# Altium schematic sheet Buttonboard.SchDoc
size A
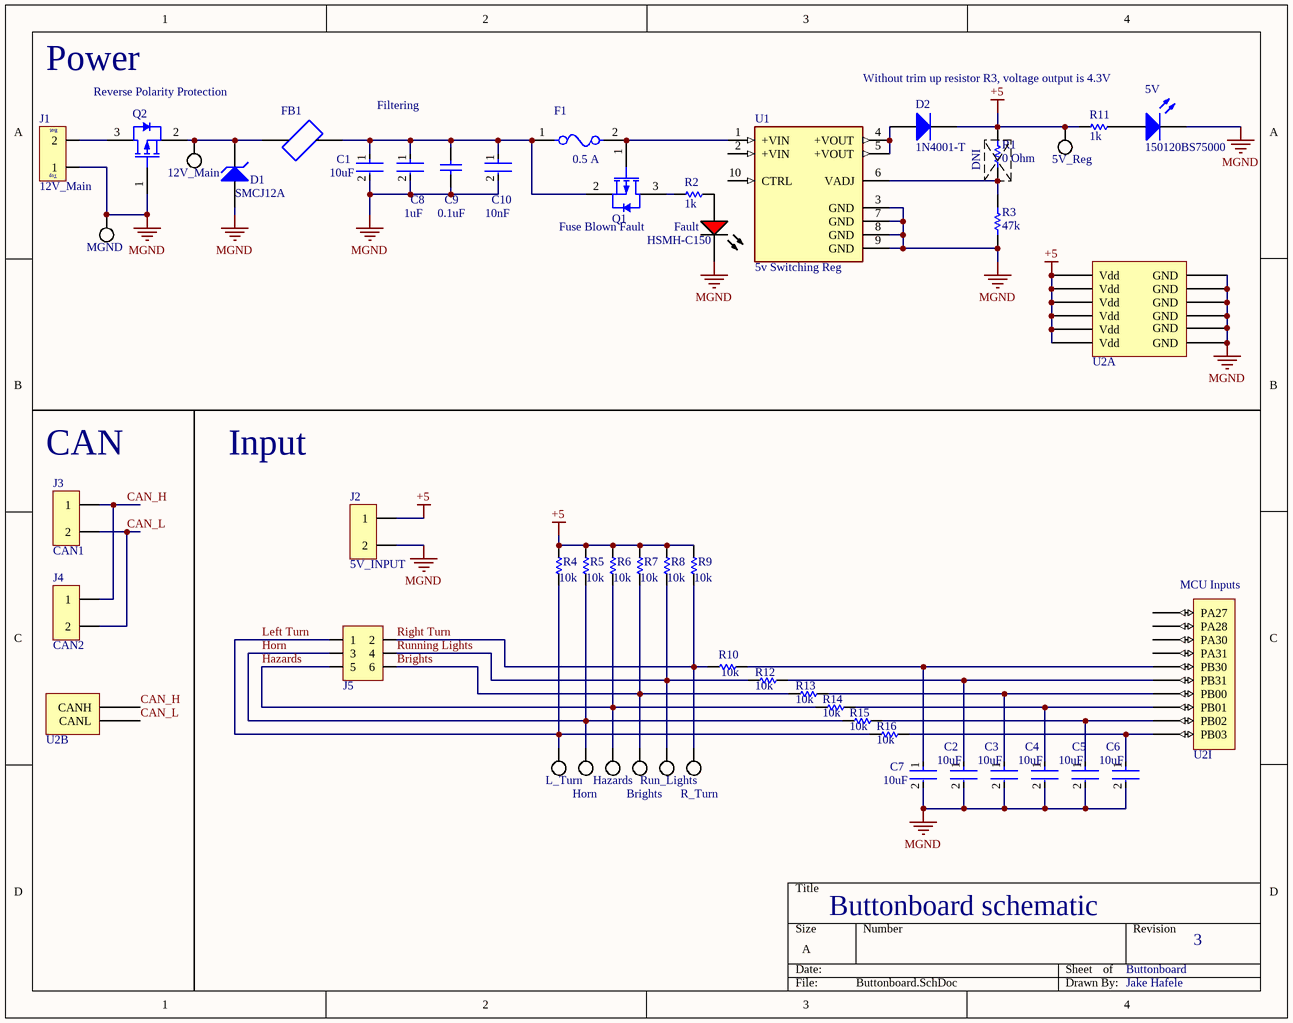
[diagram p0: Buttonboard.SchDoc]

## Parts
5V  150120BS75000  [1206_A]
5V_Reg  EPAD  [EPAD]  (value not drawn)  (no BOM)
12V_Main  EPAD  [EPAD]  (value not drawn)  (no BOM)
Brights  EPAD  [EPAD]  (value not drawn)  (no BOM)
C1  Capacitance: 10uF  [FP-CL31-IPC_A]  (hidden comment: CL31A106MOHNNNE)
C2  Capacitance: 10uF  [FP-CL31-IPC_A]  (hidden comment: CL31A106MOHNNNE)
C3  Capacitance: 10uF  [FP-CL31-IPC_A]  (hidden comment: CL31A106MOHNNNE)
C4  Capacitance: 10uF  [FP-CL31-IPC_A]  (hidden comment: CL31A106MOHNNNE)
C5  Capacitance: 10uF  [FP-CL31-IPC_A]  (hidden comment: CL31A106MOHNNNE)
C6  Capacitance: 10uF  [FP-CL31-IPC_A]  (hidden comment: CL31A106MOHNNNE)
C7  Capacitance: 10uF  [FP-CL31-IPC_A]  (hidden comment: CL31A106MOHNNNE)
C8  Capacitance: 1uF  [FP-CL31-IPC_A]  (hidden comment: CL31F105ZOCNNNC)
C9  Capacitance: 0.1uF  [CAPC2013X94X50LL20T25]  (hidden comment: 08055C104JAT2A)
C10  Capacitance: 10nF  [FP-CGA3E-0_3-0_1-IPC_A]  (hidden comment: CGA3E2X8R2A103K080AD)
D1  SMCJ12A  [LFUS-DO-214AB-2_V]
D2  1N4001-T  [DIOD-DO-41-P-2_V]
DNI  DO NOT INSTALL  (value not drawn)  (graphical)
F1  0.5 A  [FP-0155-MFG]
Fault  HSMH-C150  [AVAG-HSMX-C150_V]
FB1  HI1206N800R-10  [FB_HI1206N800R-10]  (value not drawn)
Hazards  EPAD  [EPAD]  (value not drawn)  (no BOM)
Horn  EPAD  [EPAD]  (value not drawn)  (no BOM)
J1  12V_Main  [CONN_2P_MEGAFIT_HORIZONTAL]
J2  5V_INPUT  [Mini-Fit Jr. 2]
J3  CAN1  [Mini-Fit Jr. 2]
J4  CAN2  [Mini-Fit Jr. 2]
J5  Molex Mini-Fit Jr. 6-Pin  [Molex Mini-Fit Jr. 6-Pin]  (value not drawn)
L_Turn  EPAD  [EPAD]  (value not drawn)  (no BOM)
MGND  EPAD  [EPAD]  (value not drawn)  (no BOM)
Q1  Fuse Blown Fault  [INTR-SOT-23-3_V]
Q2  Reverse Polarity Protection  [INTR-SOT-23-3_V]
R1  0 Ohm  [RESC2013X50X30LL20T20]
R2  value 1k  [0805_B]  (hidden comment: Resistor)
R3  47k  [RESC2013X60X35ML10T20]
R4  value 10k  [0805_B]  (hidden comment: 1% 1/8W)
R5  value 10k  [0805_B]  (hidden comment: 1% 1/8W)
R6  value 10k  [0805_B]  (hidden comment: 1% 1/8W)
R7  value 10k  [0805_B]  (hidden comment: 1% 1/8W)
R8  value 10k  [0805_B]  (hidden comment: 1% 1/8W)
R9  value 10k  [0805_B]  (hidden comment: 1% 1/8W)
R10  value 10k  [0805_B]  (hidden comment: 1% 1/8W)
R11  value 1k  [0805_B]  (hidden comment: Resistor)
R12  value 10k  [0805_B]  (hidden comment: 1% 1/8W)
R13  value 10k  [0805_B]  (hidden comment: 1% 1/8W)
R14  value 10k  [0805_B]  (hidden comment: 1% 1/8W)
R15  value 10k  [0805_B]  (hidden comment: 1% 1/8W)
R16  value 10k  [0805_B]  (hidden comment: 1% 1/8W)
R_Turn  EPAD  [EPAD]  (value not drawn)  (no BOM)
Run_Lights  EPAD  [EPAD]  (value not drawn)  (no BOM)
U1  5v Switching Reg  [5v Reg]
U2  S+  [Compute S+]  (value not drawn)  (parts A,B,I of 9)

## Nets
+5: 5V_Reg.1 D2.2(K) J2.1 R1.2 R4.2 R5.2 R6.2 R7.2 R8.2 R9.2 R11.2 U2.Vdd
MGND: 5V.1(K) C1.2 C2.2 C3.2 C4.2 C5.2 C6.2 C7.2 C8.2 C9.1 C10.2 D1.1(A) Fault.2(K) J1.1 J2.2 MGND.1 Q2.1(GATE) R3.1 U1.3(GND) U1.7(GND) U1.8(GND) U1.9(GND) U2.GND
Brights: Brights.1 J5.6 R7.1 R13.2
CAN_H: J3.1 J4.1 U2.CANH
CAN_L: J3.2 J4.2 U2.CANL
Hazards: Hazards.1 J5.5 R6.1 R14.2
Horn: Horn.1 J5.3 R5.1 R15.2
Left Turn: J5.1 L_Turn.1 R4.1 R16.2
Right Turn: J5.2 R9.1 R10.2 R_Turn.1
Running Lights: J5.4 R8.1 R12.2 Run_Lights.1
Net5V_2: 5V.2(A) R11.1
Net12V_Main_1: 12V_Main.1 D1.2(K) FB1.1 Q2.2(SOURCE)
NetC1_1: C1.1 C8.1 C9.2 C10.1 F1.1 FB1.2 Q1.2(SOURCE)
NetC2_1: C2.1 R12.1 U2.PB31
NetC3_1: C3.1 R13.1 U2.PB00
NetC4_1: C4.1 R14.1 U2.PB01
NetC5_1: C5.1 R15.1 U2.PB02
NetC6_1: C6.1 R16.1 U2.PB03
NetC7_1: C7.1 R10.1 U2.PB30
NetD2_1: D2.1(A) U1.4(+VOUT) U1.5(+VOUT)
NetF1_2: F1.2 Q1.1(GATE) U1.1(+VIN)
NetFault_1: Fault.1(A) R2.2
NetJ1_2: J1.2 Q2.3(DRAIN)
NetQ1_3: Q1.3(DRAIN) R2.1
NetR1_1: R1.1 R3.2 U1.6(VADJ)

Not connected (* = marked no-connect by the designer): U1 2(+VIN) 10(CTRL); U2 PA27 PA28 PA30 PA31

## Notes on the sheet
- Power
- Without trim up resistor R3, voltage output is 4.3V
- Filtering
- (near J3) CAN
- Input
- (near U2) MCU Inputs
- Buttonboard schematic
- Buttonboard
- 3
- Jake Hafele
- (in symbol CONN_2P_MEGAFIT_HORIZONTAL) Bot.; Top

## Library data of the parts
5V = CMP-1426-00015-1: SMD mono-color Chip LED, WL-SMCW, Blue; Manufacturer: Wuerth Elektronik; ComponentLink2Description: Datasheet; ComponentLink1URL: http://www.we-online.com; PartNumber: 150120BS75000; ComponentLink1Description: Manufacturer URL; ComponentLink2URL: http://katalog.we-online.com/led/datasheet/150120BS75000.pdf; PackageReference: 1206_A; Color: Blue
5V_Reg 12V_Main Brights Hazards Horn L_Turn MGND R_Turn Run_Lights = EPAD: Pad for probing signals
C1-C7 = CMP-13271-002453-1: Cap Ceramic 10uF 16V X5R ±20% SMD 1206 +85°C Embossed T/R; Thickness: 0.071inch; Case Code (Imperial): 1206; Case Code (Metric): 3216; Height: 1.6mm; Max Operating Temperature: 85°C; Voltage Rating: 16V; Package Quantity: 1; Length: 3.2mm; Dielectric: X5R; Voltage Rating (DC): 16V; Tolerance: 20%; Case/Package: 1206; Depth: 1.6mm; Mount: Surface Mount; Radiation Hardening: No; Width: 0.063inch; Lead Free: Lead Free; Min Operating Temperature: -55°C; Packaging: Tape and Reel
C8 = CMP-13271-003959-1: Cap Ceramic 1uF 16V Y5V -20/+80% SMD 1206 +85°C Embossed T/R; Tolerance: 80%; Length: 3.2mm; Package Quantity: 4000; Lead Free: Lead Free; Height: 0.85mm; Packaging: Tape and Reel; Max Operating Temperature: 85°C; Case Code (Imperial): 1206; Case/Package: 1206; Dielectric: Y5V; Min Operating Temperature: -30°C; Voltage Rating (DC): 16V; Width: 0.063inch; Mount: Surface Mount; Voltage Rating: 16V; Depth: 1.6mm; Thickness: 0.039inch; Radiation Hardening: No; Case Code (Metric): 3216
C9 = CMP-2000-05808-1: Chip Capacitor, 0.1 uF, +/- 5%, 50 V, -55 to 125 degC, 0805 (2012 Metric), RoHS, Tape and Reel; Case Width: 1.25mm; Case Length: 2.01mm; Case Height: 0.94mm; Brand: AVX; Type: StandardX7RMLCCs; Capacitance - nF: 100nF; Dissipation Factor DF: 2.5; Voltage Rating DC: 50V; Temperature Coefficient / Code: +/-15%; Capacitance - pF: 100000pF; Dielectric: X7R; Dimensions: 1.25mmWx2.01mmLx0.94mmH; Product: GeneralTypeMLCCs; Package Description: 2-Pin Surface Mount Device, Body 2.01 x 1.25 mm; Package / Case: 0805(2012metric); Product Category: MultilayerCeramicCapacitorsMLCC-SMD/SMT; Case Code - mm: 2012; Packaging: Reel; Manufacturer URL: http://www.avx.com/; Operating Temperature Range: -55Cto+125C; Termination Style: SMD/SMT; Maximum Operating Temperature: +125C; Case Code - in: 0805; Minimum Operating Temperature: -55C; Factory Pack Quantity: 4000; RoHS: Details; Voltage Rating: 50V; Tolerance: 5%; Package Reference: 0805; Datasheet URL: http://www.farnell.com/datasheets/1679506.pdf; Manufacturer: AVX; Mounting Technology: SurfaceMount; Datasheet Version: 11/2012
C10 = CMP-08246-000769-1: Cap Ceramic 10nF 100V X8R 10% Pad SMD 0603 +150°C Automotive T/R; Mount: Surface Mount; Voltage Rating (DC): 100V; Termination: SMD/SMT; Dielectric: X8R; Case/Package: 0603; Ratings: AEC-Q200; Voltage Rating: 100V; Packaging: Tape and Reel; Thickness: 0.035inch; Composition: Ceramic; Max Operating Temperature: 150°C; Width: 0.031inch; Height: 0.8mm; Weight: 7.1E-05oz; Depth: 0.8mm; Min Operating Temperature: -55°C; Length: 1.6mm; Case Code (Metric): 1608; Tolerance: 10%; Package Quantity: 4000; Case Code (Imperial): 0603
D1 = CMP-2000-07101-1: Transient Voltage Suppression Diode, 12 V, -65 to 150 degC, 2-Pin DO-214AB (SMCJ), RoHS, Tape and Reel; Manufacturer: Littelfuse; Directional: Uni-Directional; Breakdown Voltage-Max: 14.7V; Clamping Voltage-Max: 19.9V; Breakdown Voltage-Min: 13.3V; Power Dissipation: 1500W; Manufacturer URL: http://www.littelfuse.com/; Datasheet Version: 11/2015; Package Description: 2-Pin Surface Mount Device, Body 6.855 x 5.905 mm; Package Reference: DO-214AB; Mounting Technology: SurfaceMount; Datasheet URL: http://www.littelfuse.com/products/tvs-diodes/surface-mount/~/media/electronics/datasheets/tvs_diodes/littelfuse_tvs_diode_smcj_datasheet.pdf.pdf
D2 = CMP-0639-00006-2: 1.0 A Rectifier, 15 pF, 50 V, -65 to 150 degC, 2-Pin DO-41 Plastic, RoHS, Tape and Reel; Manufacturer: Diodes Inc; VF (V): 1; CT (pF): 15; Max. IR (uA): 5; VRRM (V): 50; Max. IFSM (A): 30; RoHS: TRUE; Mounting Technology: Through Hole; PartNumber: 1N4001-T; ComponentLink2Description: Datasheet; DatasheetVersion: Rev. 8-2; Operating Temperature Range (degC): -65 to 150; Packing: Tape and Reel; PackageReference: DO-41-P-2; ComponentLink1URL: http://diodes.com/; PackageDescription: 2-Pin Axial Lead, Body 4.635 x 2.36 mm, Lead Spread 25.4 mm; ComponentLink2URL: http://diodes.com/datasheets/ds28002.pdf; Max. Average Rectified Current IO (A): 1; ComponentLink1Description: Manufacturer URL
DNI = DNI
F1 = CMP-08604-000021-1: FUSE BLOK CARTRIDGE 125V 10A SMD; Manufacturer: Littelfuse Inc; Manufacturer Part Number: 01550900M; Conn Orientation: Horizontal; Fuse Current: 8A; Number Of Fuses: 1; RoHS: TRUE; Device Class L1: Circuit Protection; Package: 0155; Automotive: No; ComponentLink2Description: Datasheet; Lead Free: Yes; Voltage Rating Ac: 125V; ComponentLink2URL: https://www.littelfuse.com/~/media/electronics/datasheets/fuses/littelfuse_fuse_154_154t_154l_154tl_datasheet.pdf.pdf; Octopart: https://octopart.com/01550900m-littelfuse-9291575; Height: 3.81mm; Digikey Description: FUSE BLOK CARTRIDGE 125V 10A SMD; Category: Fuse; Device Class L2: Fuse Holders; Device Class L3: unset; Mouser Description: Fuse Holder ACS NANO HLDR
Fault = CMP-2000-06426-1: LED Uni-Color Red, 65 mW, 25 mA, -40 to 85 degC, 2-Pin SMD, RoHS, Tape and Reel; Manufacturer: Avago; Product Height (mm): 1.1mm; Power Dissipation: 78W; Product Length (mm): 3.2mm; Forward Voltage: 2.6V; Luminous Intensity: 17mcd; DELETED: Compliant; Shape Type: Rectangular; Peak Wavelength: 660nm; Main Category: ChipLED; Dominant Wave Length: 639nm; Rad Hardened: No; Lens Type: ColorlessDiffused; Product Depth (mm): 1.6mm; Reverse Voltage: 5V; Forward Current: 25mA; Chip Material: GaAlAs; Test Current (It): 20mA; Viewing Angle: 170deg; Number of  Elements: 1; Type: Uni-Color; Package Reference: HSMX-C150; Package Description: 2-Pin Surface Mount Device, Body 3.2 x 1.6 mm; Operating Temp Range: -40Cto85C; Mounting: SurfaceMount; Emitting Color: Red; Pin Count: 2; Operating Temperature Classification: Industrial; Datasheet URL: http://media.digikey.com/pdf/Data%20Sheets/Avago%20PDFs/HSMz-Czzz.pdf; Package Type: ChipLed; Mounting Technology: SurfaceMount; High Brightness: No; Lens Dimensions: 2x1.6x0.6mm; Manufacturer URL: http://www.avagotech.com/; Lum Intensity: 17mcd; Datasheet Version: 03/2012; Packaging: TapeandReel
FB1 = HI1206N800R-10: 80 Ohms @ 100MHz 1 Power, Signal Line Ferrite Bead 1206 (3216 Metric) 3A 35mOhm; MF: Laird-Signal Integrity; SnapEDA_Link: https://www.snapeda.com/parts/HI1206N800R-10/Laird-Signal%20Integrity%20Products/view-part/296889/?ref=snap; Purchase-URL: https://pricing.snapeda.com/search/part/HI1206N800R-10/?ref=eda; Check_prices: https://www.snapeda.com/parts/HI1206N800R-10/Laird-Signal%20Integrity%20Products/view-part/296889/?ref=eda; Value: *; Digi-Key_Part_Number: 240-2409-1-ND; Package: 1206 Laird-Signal Integrity; MP: HI1206N800R-10
J1 = CONN_2P_MEGAFIT_HORIZONTAL: *; Manufacturer Part Number: 0768250002; Manufacturer: Molex; SchematicInformation: MegaFit_2P; DigiKey Part Number: WM11969-ND
J2-J4 = Mini-Fit Jr. 2-pin: Mini-Fit Jr. 2-pin Right Angle; Manufacturer: Molex Inc; Manufacturer Part Number: 0039300020; Connector Type: Header, Shrouded; Number of Positions: 2; Number of Positions Loaded: All; Row Spacing: 0.165" (4.20mm); Ordering: http://search.digikey.com/scripts/DkSearch/dksus.dll?Detail&name=WM1351-ND; Datasheet: http://www.molex.com/pdm_docs/sd/039301020_sd.pdf; Supplier 1: Digi-Key; RoHS: RoHS Compliant; Category: Connectors, Interconnects; Stock 1: 371; Pricing 1: 1=0.77, 10=0.674, 50=0.6078, 100=0.5815, 250=0.5286, 500=0.47574, 1000=0.42288, 2500=0.38324, 5000=0.37002 (USD); Contact Type: Male Pin; Pitch: -; Number of Rows: 2; Contact Mating Length: -; Mounting Type: Through Hole, Right Angle; Termination: Solder; Fastening Type: Locking Ramp; Features: Board Lock; Contact Finish: Tin; Contact Finish Thickness: 200µin (5.08µm); Color: Natural; Packaging: Tray; ComponentLink1URL: http://www.molex.com/pdm_docs/sd/039300020_sd.pdf; ComponentLink1Description: http://www.molex.com/pdm_docs/sd/039300020_sd.pdf; Supplier Part Number 1: WM21351-ND
J5 = Molex Mini-Fit Jr. 6-Pin: 6-Pin Molex Mini-Fit Jr. Header  through hole; Drawn By: Aaron Mills; Drawing Date: Jan. 2, 2011; Manufacturer: Molex; ComponentLink1URL: http://www.molex.com/pdm_docs/sd/039295063_sd.pdf; ComponentLink1Description: Datasheet; ComponentLink2Description: Mechanical Drawing; Supplier 1: http://search.digikey.com/scripts/DkSearch/dksus.dll?Detail&name=WM3922-ND
Q1 Q2 = CMP-2000-04987-1: HEXFET(R) Power P-Channel MOSFET, -20 V, -3.7 A, -55 to 150 degC, 3-Pin SOT-23, RoHS, Tape and Reel; Manufacturer: International Rectifier; Drain-to-Source Voltage [Vdss]: 20V; Rated Power Dissipation: 1.3W; Qg Gate Charge: 8nC; Drain-Source On Resistance-Max: 0.065O; Channel Type: P-Channel; Package Reference: SOT-23-3; Manufacturer URL: http://internationalrectifier.com/; Datasheet URL: http://datasheet.octopart.com/IRLML6402TRPBF-International-Rectifier-datasheet-93882.pdf; Datasheet Version: Feb-05; Package Description: 3-Pin Small Outline Transistor, Body 2.92 x 1.3 mm, Pitch 0.95 mm
R1 = CMP-2001-03828-1: Part Number: CRCW080533K0JNEA; Manufacturer: Vishay Dale
R3 = CMP-2001-01296-1: Manufacturer: Yageo; Part Number: RC0805FR-078K66L
R4-R10 R12-R16 = MCR10EZHF1002: 0805 10kOhm resistor 1% 1/8W; ComponentLink1Description: Datasheet; ComponentLink1URL: http://media.digikey.com/pdf/Data%20Sheets/Rohm%20PDFs/MCR10%20(new)%20series.pdf
U1 = 5v Switching Reg: 1A DC/DC-Converter 'INNOLINE' SMD reg; MF: Recom Power; MP: R-78AA5.0-1.0SMD-R; Value: *; Package: SMD-10 Recom Power; DigiKey-Purchase-URL: https://snapeda.com/shop?store=DigiKey&id=480105; SnapEDA_Link: https://www.snapeda.com/parts/R-78AA5.0-1.0SMD-R/Recom%20Power/view-part/480105/?ref=snap; Mouser-Purchase-URL: https://snapeda.com/shop?store=Mouser&id=480105; Digi-Key_Part_Number: 945-1044-1-ND; BuyPart: https://www.snapeda.com/parts/R-78AA5.0-1.0SMD-R/Recom%20Power/view-part/480105/?ref=eda; DigiKey: 945-1044-2-ND
U2 = S+: Need to get 4 of PPPC161LFBN-RC; Digi-key: https://www.digikey.com/product-detail/en/sullins-connector-solutions/PPPC161LFBN-RC/S7049-ND/810188; datasheet: https://media.digikey.com/pdf/Data%20Sheets/Sullins%20PDFs/Female_Headers.100_DS.pdf